# EAGLE design modEEGamp_v1.1 - Single (EAGLE 7.6.0)
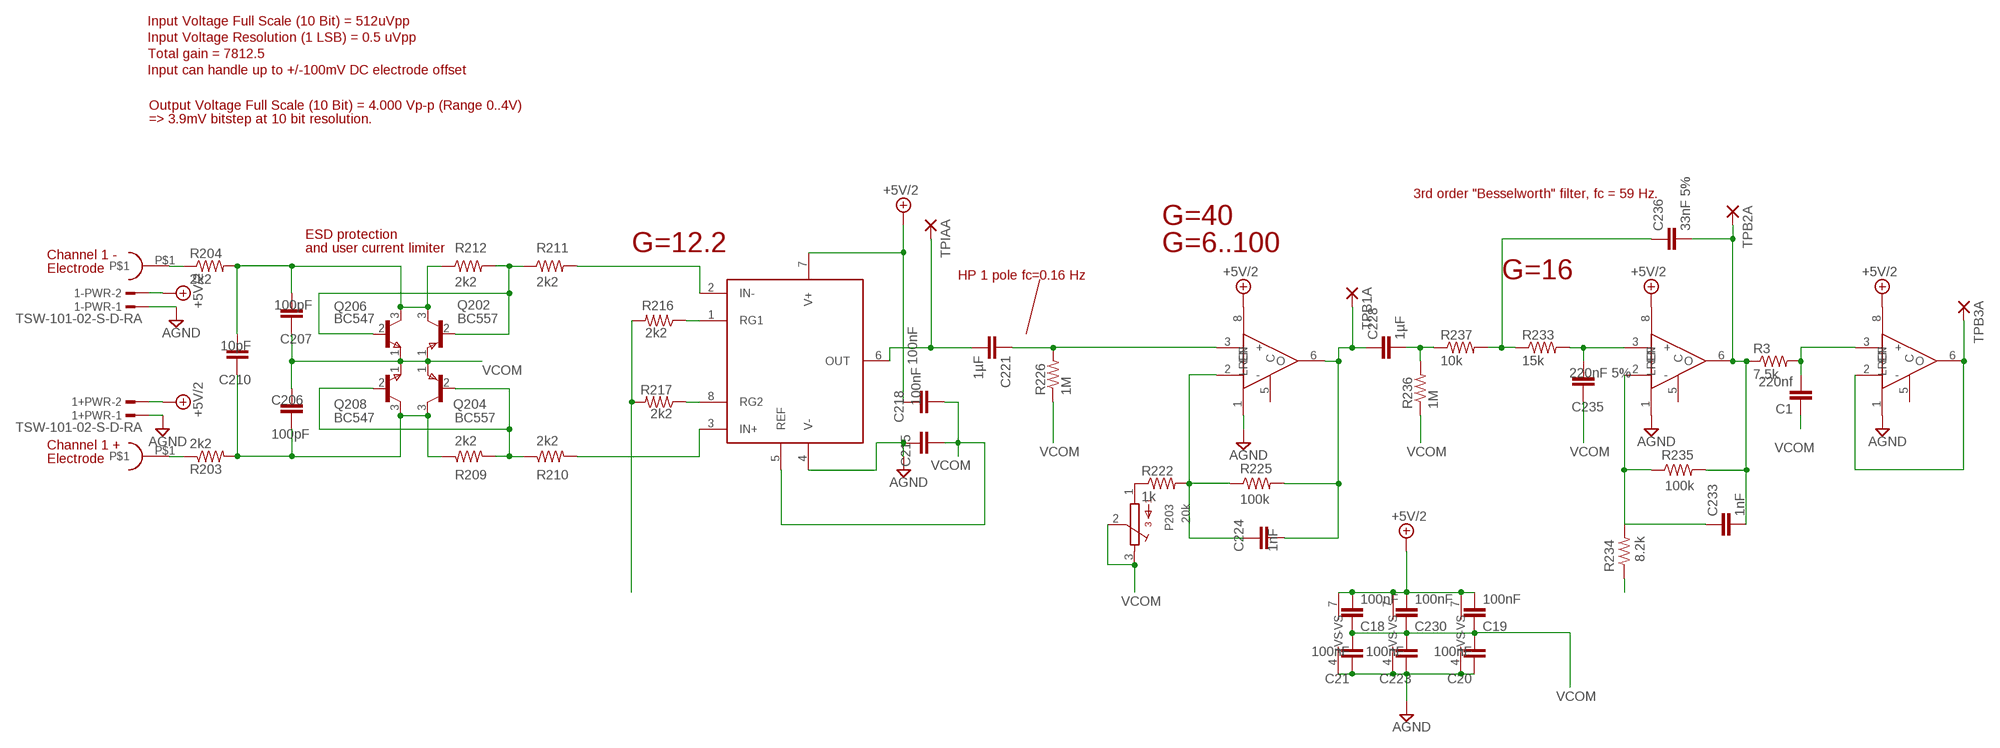
[diagram p0: schematic, sheet 1]

## Parts
1+PWR  TSW-101-02-S-D-RA  [TSW-101-02-S-D-RA]
1-PWR  TSW-101-02-S-D-RA  [TSW-101-02-S-D-RA]
C1  220nf  C-EUC1206  [C1206]
C1+  DIN42802  [DIN42802]
C1-  DIN42802  [DIN42802]
C18  100nF  C-EUC1206  [C1206]
C19  100nF  C-EUC1206  [C1206]
C20  100nF  C-EUC1206  [C1206]
C21  100nF  C-EUC1206  [C1206]
C206  100pF  C-EUC1206  [C1206]
C207  100pF  C-EUC1206  [C1206]
C210  10pF  C-EUC1206  [C1206]
C215  100nF  C-EUC1206  [C1206]
C218  100nF  C-EUC1206  [C1206]
C221  1µF  C-EU050-024X044  [C050-024X044]
C223  100nF  C-EUC1206  [C1206]
C224  1nF  C-EUC1206  [C1206]
C228  1µF  C-EU050-024X044  [C050-024X044]
C230  100nF  C-EUC1206  [C1206]
C233  1nF  C-EUC1206  [C1206]
C235  220nF 5%  C-EUC1206  [C1206]
C236  33nF 5%  C-EUC1206  [C1206]
P203  20k  S64Y  [S64Y]
Q202  BC557  [TO92]
Q204  BC557  [TO92]
Q206  BC547  [TO92]
Q208  BC547  [TO92]
R3  7.5k  R-US_R1206  [R1206]
R203  2k2  R-US_R1206  [R1206]
R204  2k2  R-US_R1206  [R1206]
R209  2k2  R-US_R1206  [R1206]
R210  2k2  R-US_R1206  [R1206]
R211  2k2  R-US_R1206  [R1206]
R212  2k2  R-US_R1206  [R1206]
R216  2k2  R-US_R1206  [R1206]
R217  2k2  R-US_R1206  [R1206]
R222  1k  R-US_R1206  [R1206]
R225  100k  R-US_R1206  [R1206]
R226  1M  R-US_R1206  [R1206]
R233  15k  R-US_R1206  [R1206]
R234  8.2k  R-US_R1206  [R1206]
R235  100k  R-US_R1206  [R1206]
R236  1M  R-US_R1206  [R1206]
R237  10k  R-US_R1206  [R1206]
TPB1A  1,6/0,8  [1,6/0,8]
TPB2A  1,6/0,8  [1,6/0,8]
TPB3A  1,6/0,8  [1,6/0,8]
TPIAA  1,6/0,8  [1,6/0,8]
U$1  INA217  [DIL-08]
U$2  AD8021  [SOIC8]
U$3  AD8021  [SOIC8]
U$16  AD8021  [SOIC8]

## Nets
+5V/2: 1+PWR.2 1-PWR.2 C18.2 C19.2 C218.1 C230.2 U$1.7(V+) U$2.7(SUPPLY:+VS) U$2.8(IC:EN) U$3.7(SUPPLY:+VS) U$3.8(IC:EN) U$16.7(SUPPLY:+VS) U$16.8(IC:EN)
ADIN0: TPB3A.1(P) U$16.2(IC:-) U$16.6(IC:O)
AGND: 1+PWR.1 1-PWR.1 C20.1 C21.1 C215.1 C223.1 U$1.4(V-) U$2.1(IC:LREF) U$2.4(SUPPLY:-VS) U$3.1(IC:LREF) U$3.4(SUPPLY:-VS) U$16.1(IC:LREF) U$16.4(SUPPLY:-VS)
N$1: R216.1 U$1.1(RG1)
N$2: R217.1 U$1.8(RG2)
N$5: C233.2 C236.2 R3.1 R235.2 TPB2A.1(P) U$3.6(IC:O)
N$6: C1-.P$1 R204.1
N$10: C1.2 R3.2 U$16.3(IC:+)
N$11: C1+.P$1 R203.1
N$12: R216.2 R217.2
N$21: R211.2 U$1.2(IN-)
N$25: C221.2 TPIAA.1(P) U$1.6(OUT)
N$27: R210.2 U$1.3(IN+)
N$28: C221.1 R226.2 U$2.3(IC:+)
N$29: Q202.2(B) Q206.2(B) R211.1 R212.2
N$32: C207.2 C210.2 Q202.3(C) Q206.3(C) R204.2 R212.1
N$38: C224.1 R222.2 R225.1 U$2.2(IC:-)
N$39: Q204.2(B) Q208.2(B) R209.2 R210.1
N$40: P203.1 R222.1
N$42: C224.2 C228.1 R225.2 TPB1A.1(P) U$2.6(IC:O)
N$43: C206.1 C210.1 Q204.3(C) Q208.3(C) R203.2 R209.1
N$49: C233.1 R234.2 R235.1 U$3.2(IC:-)
N$50: C228.2 R236.2 R237.1
N$51: C236.1 R233.1 R237.2
N$57: C235.2 R233.2 U$3.3(IC:+)
VCOM: C1.1 C18.1 C19.1 C20.2 C21.2 C206.2 C207.1 C215.2 C218.2 C223.2 C230.1 C235.1 P203.2 P203.3 Q202.1(E) Q204.1(E) Q206.1(E) Q208.1(E) R226.1 R234.1 R236.1 U$1.5(REF)
Unconnected: U$2.5(IC:C) U$3.5(IC:C) U$16.5(IC:C)

## Notes on the sheet
- Input Voltage Full Scale (10 Bit) = 512uVpp
- Input Voltage Resolution (1 LSB) = 0.5 uVpp
- Total gain = 7812.5
- Input can handle up to +/-100mV DC electrode offset
- Output Voltage Full Scale (10 Bit) = 4.000 Vp-p (Range 0..4V)
- => 3.9mV bitstep at 10 bit resolution.
- 3rd order "Besselworth" filter, fc = 59 Hz.
- G=40
- ESD protection
- and user current limiter | G=12.2 | G=6..100
- Channel 1 -
- Electrode
- HP 1 pole fc=0.16 Hz | G=16
- Channel 1 +
- Electrode

## Library data of the parts
1+PWR 1-PWR = con-samtec:TSW-101-02-S-D: THROUGH-HOLE .025" SQ POST HEADER Source: Samtec TSW.pdf; OC_FARNELL: unknown; OC_NEWARK: unknown
C1 C18-C21 C206 C207 C210 C215 C218 C221 C223 C224 C228 C230 C233 C235 C236 = resistor:C-EU: CAPACITOR, European symbol
C1+ C1- = modEEG:DIN42802
P203 = TRIMPOT@2:S64Y
Q202 Q204 = pnp:BC557
Q206 Q208 = NPN:BC547
R3 R203 R204 R209-R212 R216 R217 R222 R225 R226 R233-R237 = resistor:R-US_: RESISTOR, American symbol
TPB1A TPB2A TPB3A TPIAA = WIREPAD:1,6/0,8: THROUGH-HOLE PAD
U$1 = modEEG:INA217
U$2 U$3 U$16 = EEG:AD8021

## Board
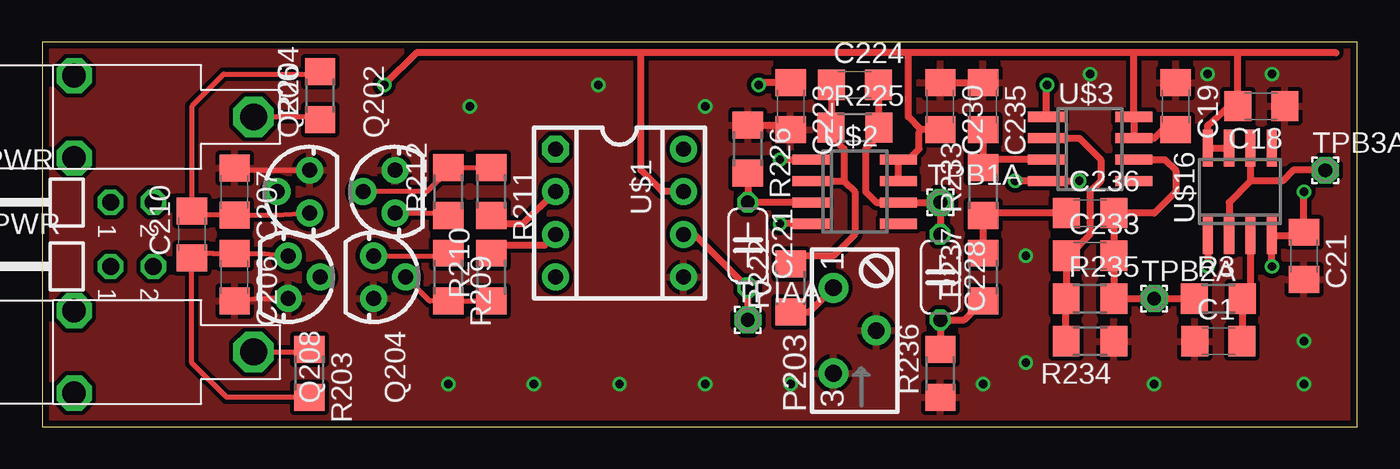
[diagram p1: board, top side]
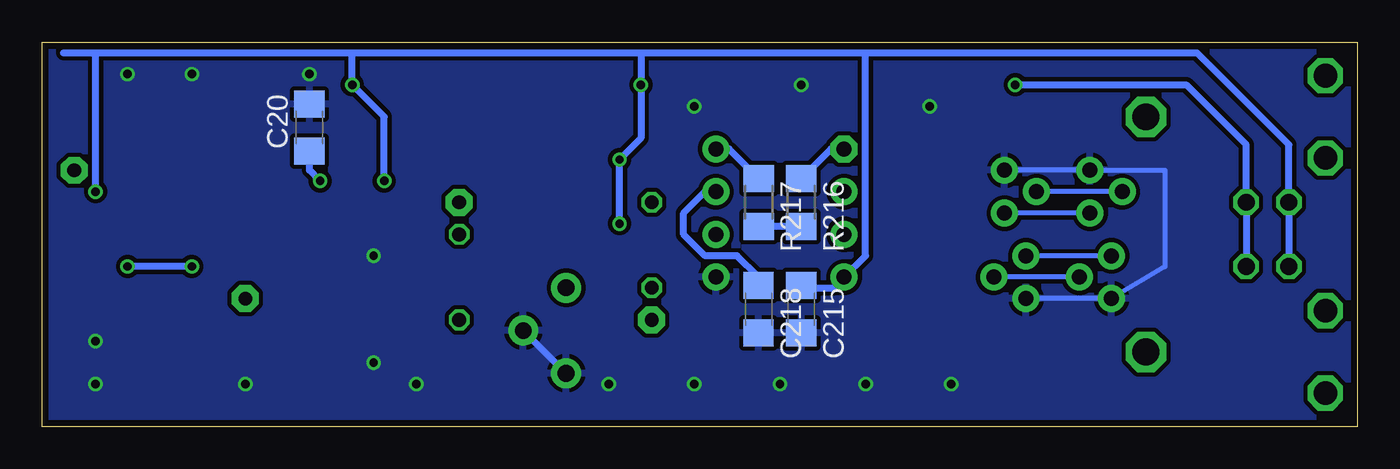
[diagram p2: board, bottom side, seen from below]

Size 78.11 x 22.86 mm. Coordinates in mm from the lower left corner, seen from the top.
Outline: 0,0 78.11,0 78.11,22.86 0,22.86 0,0
Copper layers (1*16): Top 0.0356mm / dielectric 1.5011mm / Bottom 0.0356mm
Design rules "Oshpark": minimum track width 6mil, minimum drill 13mil, track to track 6mil, track to pad 6mil, pad to pad 6mil, via to via 6mil, smd to smd 6mil, copper to edge 15mil, drill to drill 6mil, minimum pad ring 7mil, minimum via ring 7mil, stop-mask expansion 3mil, vias tented up to drill 0mil, thermal gap 10mil

### Footprints (pad centres in the part's own frame; a part is rotated, then mirrored left to right if it is on the bottom)
TSW-101-02-S-D-RA = drill 1 pad 1.5 octagon: 1 0,1.524; 2 0,4.064
C1206 = smd 1.6 x 1.8: 1 -1.4,0; 2 1.4,0
DIN42802 = drill 1.4 octagon: MNT -2.446,0; MNT@1 2.446,0 | drill 1.6 octagon: P$1 0,-10.655
C050-024X044 = drill 0.813 octagon: 1 -2.54,0; 2 2.54,0
S64Y = drill 0.991 pad 1.778: 1 2.54,1.27; 2 0,-1.27; 3 -2.54,1.27
TO92 = drill 0.889 pad 1.6: 1 1.27,0; 2 0,1.905; 3 -1.27,0
R1206 = smd 1.6 x 1.803: 1 -1.422,0; 2 1.422,0
1,6/0,8 = drill 0.813 pad 1.6 octagon: 1 0,0
DIL-08 = drill 0.889 pad 1.6 octagon: 1 -3.81,-3.81 | drill 0.889 pad 1.6: 2 -1.27,-3.81; 3 1.27,-3.81; 4 3.81,-3.81; 5 3.81,3.81; 6 1.27,3.81; 7 -1.27,3.81; 8 -3.81,3.81
SOIC8 = smd 2.2 x 0.6: 1 -2.6,1.905; 2 -2.6,0.635; 3 -2.6,-0.635; 4 -2.6,-1.905; 5 2.6,-1.905; 6 2.6,-0.635; 7 2.6,0.635; 8 2.6,1.905

### Placement (x,y rotation side)
1+PWR  2.54,9.52 270 top
1-PWR  2.54,13.34 270 top
C1  69.85,5.08 0 top
C1+  1.91,4.45 90 top
C1-  1.91,18.41 90 top
C18  72.39,19.05 180 top
C19  67.31,19.05 270 top
C20  62.23,17.78 90 bottom
C21  74.93,10.16 270 top
C206  11.43,8.89 270 top
C207  11.43,13.97 270 top
C210  8.89,11.43 90 top
C215  33.02,6.98 270 bottom
C218  35.56,6.98 270 bottom
C221  41.91,10.8 270 top
C223  44.45,19.05 270 top
C224  48.26,20.32 0 top
C228  53.34,8.89 270 top
C230  53.34,19.05 270 top
C233  62.23,10.16 0 top
C235  55.88,19.05 270 top
C236  62.23,12.7 0 top
P203  48.26,5.71 90 top
Q202  20.95,13.97 90 top
Q204  19.68,8.89 270 top
Q206  15.88,13.97 90 top
Q208  14.61,8.89 270 top
R3  69.85,7.62 0 top
R203  15.88,3.17 270 top
R204  16.51,19.69 90 top
R209  24.13,8.89 270 top
R210  26.67,8.89 90 top
R211  26.67,13.97 270 top
R212  24.13,13.97 90 top
R216  33.02,13.34 270 bottom
R217  35.56,13.34 270 bottom
R222  44.45,8.26 90 top
R225  48.26,17.78 0 top
R226  41.91,16.51 270 top
R233  55.88,13.97 90 top
R234  62.23,5.08 180 top
R235  62.23,7.62 0 top
R236  53.34,3.17 90 top
R237  55.88,8.89 90 top
TPB1A  53.34,13.34 0 top
TPB2A  66.04,7.62 0 top
TPB3A  76.2,15.24 0 top
TPIAA  41.91,6.35 0 top
U$1  34.29,12.7 270 top
U$2  48.26,13.97 0 top
U$3  62.23,16.51 0 top
U$16  71.12,13.97 90 top

### Tracks (layer width: path | path; a pad name or v marks a point on that pad's centre or on a via)
+5V/2  (via drill 0.5)
  Top 0.406: 76.83,22.23 71.12,22.23 | 71.12,22.23 64.77,22.23 | 64.77,22.23 51.44,22.23 | 51.44,22.23 35.56,22.23 | 35.56,22.23 22.23,22.23 v20.32,20.32 | U$2.7 U$2.8 51.44,15.88 52.07,16.51 52.07,17.52 52.2,17.65 | 64.77,22.23 64.83,22.16 U$3.8 U$3.7 66.04,17.14 66.55,17.65 C19.2 | U$16.7 U$16.8 69.22,17.91 70.48,19.05 C18.2 70.99,22.09 71.12,22.23 | C230.2 52.2,17.65 | 52.2,17.65 51.44,18.41 51.44,22.23 | U$1.7 36.83,13.97 35.56,15.24 35.56,22.23
  Bottom 0.406: 1+PWR.2 1-PWR.2 6.6,16.76 10.16,20.32 v20.32,20.32 | C218.1 35.56,8.89 36.83,10.16 38.73,10.16 40.01,11.43 40.01,12.7 38.73,13.97 U$1.7
ADIN0
  Top 0.406: U$16.6 71.75,14.6 | 71.75,14.6 70.48,13.34 U$16.2 | TPB3A.1 74.3,15.24 73.66,14.6 71.75,14.6
AGND  (via drill 0.5)
  Top 0.406: U$2.4 v43.81,12.06 | v43.81,15.88 U$2.1 | U$3.1 59.63,20.26 v59.69,20.32 | v57.78,14.6 U$3.4 v61.59,14.6 | U$16.1 v69.22,9.52 | v73.03,9.52 U$16.4 74.74,11.37 C21.1 v74.93,13.97 | C223.1 42.67,20.45 v42.55,20.32
  Bottom 0.406: 1+PWR.1 1-PWR.1 4.06,16.76 9.53,22.23 29.21,22.23 | 76.83,22.23 74.93,22.23 | 74.93,22.23 59.69,22.23 | 59.69,22.23 42.55,22.23 | 42.55,22.23 29.21,22.23 | C215.1 32.89,8.26 31.11,8.26 U$1.4 29.21,10.16 29.21,22.23 | v43.81,12.06 v43.81,15.88 42.55,17.14 v42.55,20.32 42.55,22.23 | 59.69,22.23 v59.69,20.32 57.78,18.41 v57.78,14.6 | v61.59,14.6 62.23,15.24 C20.1 | v74.93,13.97 74.93,22.23 | v69.22,9.52 v73.03,9.52
N$1
  Bottom 0.406: U$1.1 31.27,16.51 R216.1
N$2
  Bottom 0.406: U$1.8 37.31,16.51 R217.1
N$5
  Top 0.406: U$3.6 66.67,15.88 67.31,15.24 67.31,13.97 66.04,12.7 C236.2 C233.2 63.63,7.64 R235.2 TPB2A.1 R3.1
N$6
  Top 0.305: C1-.P$1 16.36,18.41 R204.1
N$10
  Top 0.406: C1.2 71.27,5.1 R3.2 71.75,8.1 U$16.3
N$11
  Top 0.305: C1+.P$1 15.72,4.45 R203.1
N$12
  Bottom 0.406: R216.2 R217.2
N$21
  Top 0.406: R211.2 26.67,12.7 27.3,12.06 28.57,12.06 U$1.2
N$25
  Top 0.406: TPIAA.1 C221.2 38.73,11.43 U$1.6
N$27
  Top 0.406: R210.2 26.67,10.16 27.3,10.8 29.84,10.8 U$1.3
N$28
  Top 0.406: R226.2 C221.1 U$2.3
N$29
  Top 0.305: Q202.2 22.86,13.97 24.13,15.24 R212.2 R211.1
  Bottom 0.305: Q206.2 Q202.2
N$32
  Top 0.305: Q206.3 13.84,12.57 C207.2 9.15,12.57 C210.2 8.89,19.05 10.79,20.95 16.36,20.95 R204.2 | Q202.3 23.98,12.7 R212.1
  Bottom 0.305: Q206.3 Q202.3
N$38
  Top 0.406: C224.1 46.86,17.8 R225.1 46.84,17.3 47.62,16.51 47.62,14.6 | U$2.2 47.62,14.6 | 47.62,14.6 48.26,13.97 48.26,11.43 46.99,10.16 44.93,10.16 R222.2
N$39
  Top 0.305: Q204.2 23.01,7.47 R209.2 R210.1
  Bottom 0.305: Q208.2 Q204.2
N$40
  Top 0.406: R222.1 45.57,6.83 P203.1
N$42
  Top 0.406: C224.2 49.66,17.8 R225.2 49.68,17.3 48.9,16.51 48.9,13.97 49.53,13.34 U$2.6 TPB1A.1 C228.1
N$43
  Top 0.305: Q208.3 13.21,10.29 C206.1 10.14,10.31 9.17,10.31 C210.1 8.89,3.81 10.95,1.75 R203.2 | Q204.3 23.98,10.16 R209.1
  Bottom 0.305: Q208.3 Q204.3
N$49
  Top 0.406: U$3.2 61.59,17.14 62.87,15.88 62.87,14.6 62.23,13.97 62.23,11.43 60.96,10.16 C233.1 60.83,7.64 R235.1 R234.2
N$50
  Top 0.406: R236.2 C228.2 54.76,6.35 R237.1
N$51
  Top 0.406: R237.2 R233.1 56.03,12.7 C236.1
N$57
  Top 0.406: C235.2 R233.2 56.36,15.88 U$3.3
VCOM  (via drill 0.5)
  Top 0.305: C207.1 11.43,15.24 Q206.1 | C206.2 12.7,7.62 Q208.1
  Top 0.406: R226.1 44.17,17.93 C223.2 | C230.1 C235.1
  Bottom 0.305: Q202.1 Q206.1 11.43,15.24 11.43,9.52 Q208.1 Q204.1
  Bottom 0.406: P203.3 P203.2
  other vias: 24.13,2.54 29.21,2.54 34.29,2.54 39.37,2.54 44.45,2.54 25.4,19.05 33.02,20.32 39.37,19.05 62.23,20.95 69.22,20.95 73.03,20.95 74.93,5.08 74.93,2.54 66.04,2.54 58.42,3.81 55.88,2.54 58.42,10.16
  pour Bottom (isolate 0.254): 0,22.86 0,0 87.63,0 87.63,22.86
  pour Top (isolate 0.254): 0,22.86 0,0 83.82,0 83.82,22.86